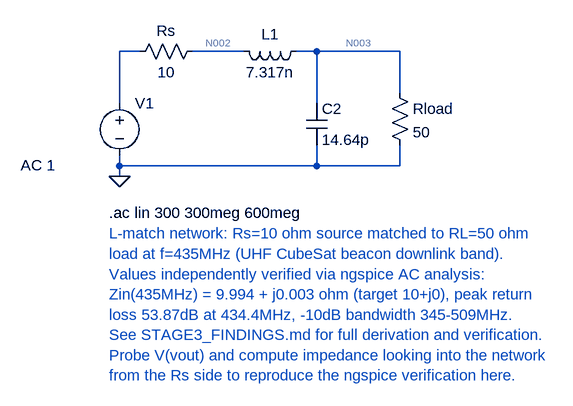
[diagram p0: schematic lmatch_network.asc]
lmatch_network.asc, the LTspice schematic file:
Version 4.1
SHEET 1 880 680
WIRE 16 96 -16 96
WIRE 176 96 96 96
WIRE 288 96 256 96
WIRE 416 96 288 96
WIRE 416 160 416 96
WIRE -16 176 -16 96
WIRE 288 176 288 96
WIRE -16 272 -16 256
WIRE 288 272 288 240
WIRE 288 272 -16 272
WIRE 416 272 416 240
WIRE 416 272 288 272
WIRE -16 288 -16 272
FLAG -16 288 0
SYMBOL voltage -16 160 R0
WINDOW 3 -152 111 Left 2
WINDOW 123 0 0 Left 2
WINDOW 39 0 0 Left 2
SYMATTR Value AC 1
SYMATTR InstName V1
SYMBOL res 112 80 R90
WINDOW 0 0 56 VBottom 2
WINDOW 3 32 56 VTop 2
SYMATTR InstName Rs
SYMATTR Value 10
SYMBOL ind 272 80 R90
WINDOW 0 5 56 VBottom 2
WINDOW 3 32 56 VTop 2
SYMATTR InstName L1
SYMATTR Value 7.317n
SYMBOL cap 272 176 R0
SYMATTR InstName C2
SYMATTR Value 14.64p
SYMBOL res 400 144 R0
SYMATTR InstName Rload
SYMATTR Value 50
TEXT -32 344 Left 2 !.ac lin 300 300meg 600meg
TEXT -32 376 Left 2 ;L-match network: Rs=10 ohm source matched to RL=50 ohm\nload at f=435MHz (UHF CubeSat beacon downlink band).\nValues independently verified via ngspice AC analysis:\nZin(435MHz) = 9.994 + j0.003 ohm (target 10+j0), peak return\nloss 53.87dB at 434.4MHz, -10dB bandwidth 345-509MHz.\nSee STAGE3_FINDINGS.md for full derivation and verification.\nProbe V(vout) and compute impedance looking into the network\nfrom the Rs side to reproduce the ngspice verification here.

The netlist it stands for:
* lmatch_network.asc
V1 N001 0 AC 1
Rs N002 N001 10
L1 N003 N002 7.317n
C2 N003 0 14.64p
Rload N003 0 50
.ac lin 300 300meg 600meg
* L-match network: Rs=10 ohm source matched to RL=50 ohm
* load at f=435MHz (UHF CubeSat beacon downlink band).
* Values independently verified via ngspice AC analysis:
* Zin(435MHz) = 9.994 + j0.003 ohm (target 10+j0), peak return
* loss 53.87dB at 434.4MHz, -10dB bandwidth 345-509MHz.
* See STAGE3_FINDINGS.md for full derivation and verification.
* Probe V(vout) and compute impedance looking into the network
* from the Rs side to reproduce the ngspice verification here.
.backanno
.end

* Results of the author's LTspice run, read from the files saved beside the schematic
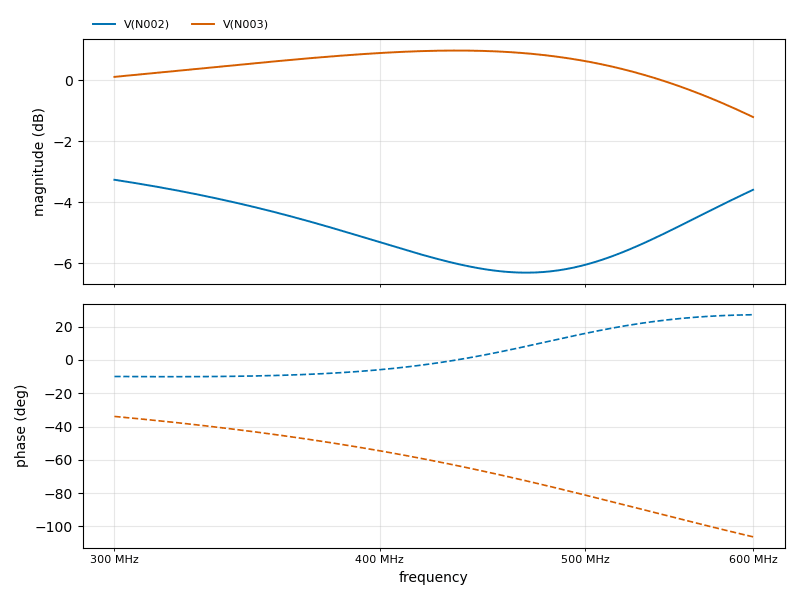
[diagram p1: AC Analysis of lmatch_network.asc, plotted from the saved traces]
* AC Analysis, 1 run:
*   V(N002): -3.27 dB at 300 MHz, -3.60 dB at 600 MHz, peak -3.27 dB at 300 MHz, 3 dB below the peak at 457.6 MHz
*   V(N003): 0.11 dB at 300 MHz, -1.21 dB at 600 MHz, peak 0.97 dB at 434.4 MHz